# EAGLE design lipo charger (EAGLE 5.11)
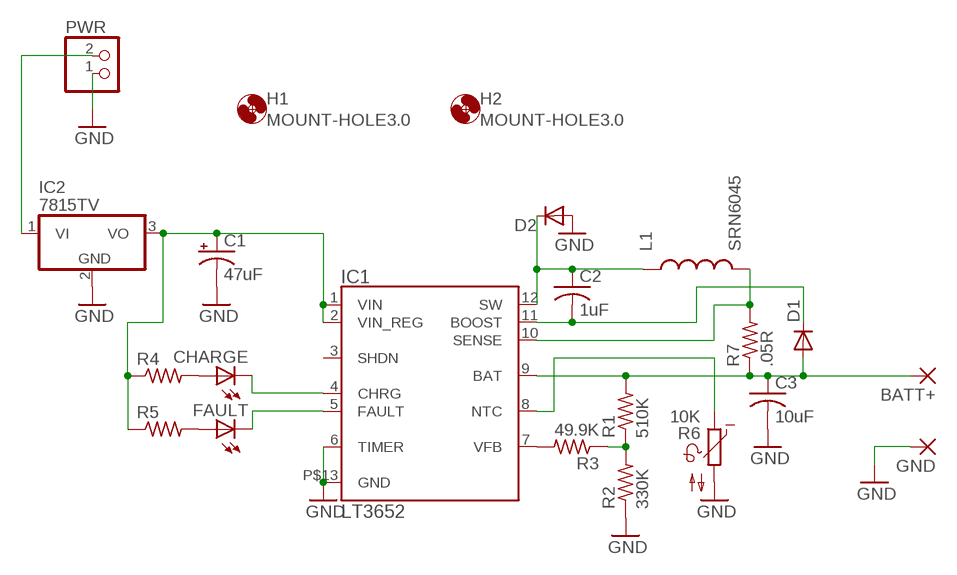
[diagram p0: schematic, sheet 1]

## Parts
BATT+  WIREPAD3,81/1,4  [3,81/1,4]
C1  47uF  CPOL-USE5-10.5  [E5-10,5]
C2  1uF  C-USC0805K  [C0805K]
C3  10uF  C-USC1206  [C1206]
CHARGE  LEDCHIPLED_0805  [CHIPLED_0805]
D1  DIODESOT23  [SOT23-3]
D2  DIODESMB  [SMB-DIODE]
FAULT  LEDCHIPLED_0805  [CHIPLED_0805]
GND  WIREPAD3,81/1,4  [3,81/1,4]
H1  MOUNT-HOLE3.0  [3,0]
H2  MOUNT-HOLE3.0  [3,0]
IC1  LT3652  [12-MSOP]
IC2  7815TV  [TO220V]
L1  SRN6045  [SRN6045]
PWR  JST_2PIN-THM  [JST-PH-2-THM]
R1  510K  R-US_R0805  [R0805]
R2  330K  R-US_R0805  [R0805]
R3  49.9K  R-US_R0805  [R0805]
R4  R-US_R0805  [R0805]
R5  R-US_R0805  [R0805]
R6  10K  NTC640  [P640]
R7  .05R  R-US_R0805  [R0805]

## Nets
GND: C1.- C3.2 D2.A GND.1(P) IC1.6(TIMER) IC1.P$13(GND) IC2.2(GND) PWR.1 R2.1 R6.2
N$1: IC1.7(VFB) R3.2
N$2: R1.1 R2.2 R3.1
N$3: BATT+.1(P) C3.1 D1.1(A) IC1.9(BAT) R1.2 R7.1
N$5: CHARGE.A R4.2
N$6: FAULT.A R5.2
N$7: CHARGE.C IC1.4(CHRG)
N$8: FAULT.C IC1.5(FAULT)
N$9: C1.+ IC1.1(VIN) IC1.2(VIN_REG) IC2.3(VO) R4.1 R5.1
N$10: IC1.8(NTC) R6.1
N$11: IC1.10(SENSE) L1.2 R7.2
N$12: C2.2 D1.3(C) IC1.11(BOOST)
N$13: C2.1 D2.C IC1.12(SW) L1.1
N$14: IC2.1(VI) PWR.2
Unconnected: IC1.3(SHDN)

## Library data of the parts
BATT+ GND = wirepad:WIREPAD: Wire PAD connect wire on PCB
C1 = adafruit:CPOL-US: POLARIZED CAPACITOR, American symbol
C2 C3 = adafruit:C-US: CAPACITOR, American symbol
CHARGE FAULT = adafruit:LED: LED OSRAM: - CHIPLED LG R971, LG N971, LY N971, LG Q971, LY Q971, LO R971, LY R971 LH N974, LH R974 LS Q976, LO Q976, LY Q976 LO Q996 - Hyper CHIPLED LW Q18S LB Q993, LB Q99A, LB R99A - SideLED LS A670, LO A670, LY A670, LG A670, LP A670 LB A673, LV A673, LT A673, LW A673 LH A674 LY A675 LS A676, LA A676, LO A676, LY A676, LW A676 LS A679, LY A679, LG A679 - Hyper Micro SIDELED® LS Y876, LA Y876, LO Y876, LY Y876 LT Y87S - SmartLED LW L88C, LW L88S LB L89C, LB L89S, LG L890 LS L89K, LO L89K, LY L89K LS L896, LA L896, LO L896, LY L896 - TOPLED LS T670, LO T670, LY T670, LG T670, LP T670 LSG T670, LSP T670, LSY T670, LOP T670, LYG T670 LG T671, LOG T671, LSG T671 LB T673, LV T673, LT T673, LW T673 LH T674 LS T676, LA T676, LO T676, LY T676, LB T676, LH T676, LSB T676, LW T676 LB T67C, LV T67C, LT T67C, LS T67K, LO T67K, LY T67K, LW E67C LS E67B, LA E67B, LO E67B, LY E67B, LB E67C, LV E67C, LT E67C LW T67C LS T679, LY T679, LG T679 LS T770, LO T770, LY T770, LG T770, LP T770 LB T773, LV T773, LT T773, LW T773 LH T774 LS E675, LA E675, LY E675, LS T675 LS T776, LA T776, LO T776, LY T776, LB T776 LHGB T686 LT T68C, LB T68C - Hyper Mini TOPLED® LB M676 - Mini TOPLED Santana® LG M470 LS M47K, LO M47K, LY M47K Source: http://www.osram.convergy.de/
D1 D2 = SparkFun:DIODE: Diode These are standard reverse protection diodes and small signal diodes. SMA package can handle up to about 1A. SOD-323 can handle about 200mA. What the SOD-323 package when ordering, there are some mfgs out there that are 5-pin packages.
H1 H2 = holes:MOUNT-HOLE: MOUNTING HOLE with drill center marker
IC1 = linear-technology:LT3652: LT3652 Power Tracking 2A Battery Charger Source: LT3652 Datasheet <http://cds.linear.com/docs/Datasheet/3652fc.pdf>
IC2 = linear:78*: Positive VOLTAGE REGULATOR Source: http://cache.national.com/ds/LM/LM78L05.pdf http://www.fairchildsemi.com/ds/LM/LM7805.pdf
L1 = bourns-inductor:SRN6045: SRN6045 SRN6045 Series - Semi-shielded Power Inductors Source: SRN6045 Series Datasheet <http://www.bourns.com/data/global/pdfs/SRN6045.pdf>
PWR = adafruit:JST_2PIN: JST 2-Pin Connectors of various flavors SMT-RA (S2B-PH-SM4) 4UConnector #17311 SMT (B2B-PH-SM4) THM-RA (S2B-PH) THM (B2B-PH)
R1-R5 R7 = adafruit:R-US_: RESISTOR, American symbol
R6 = ptc-ntc:NTC640: PHILIPS NTC; OC_FARNELL: unknown; OC_NEWARK: unknown

## Board
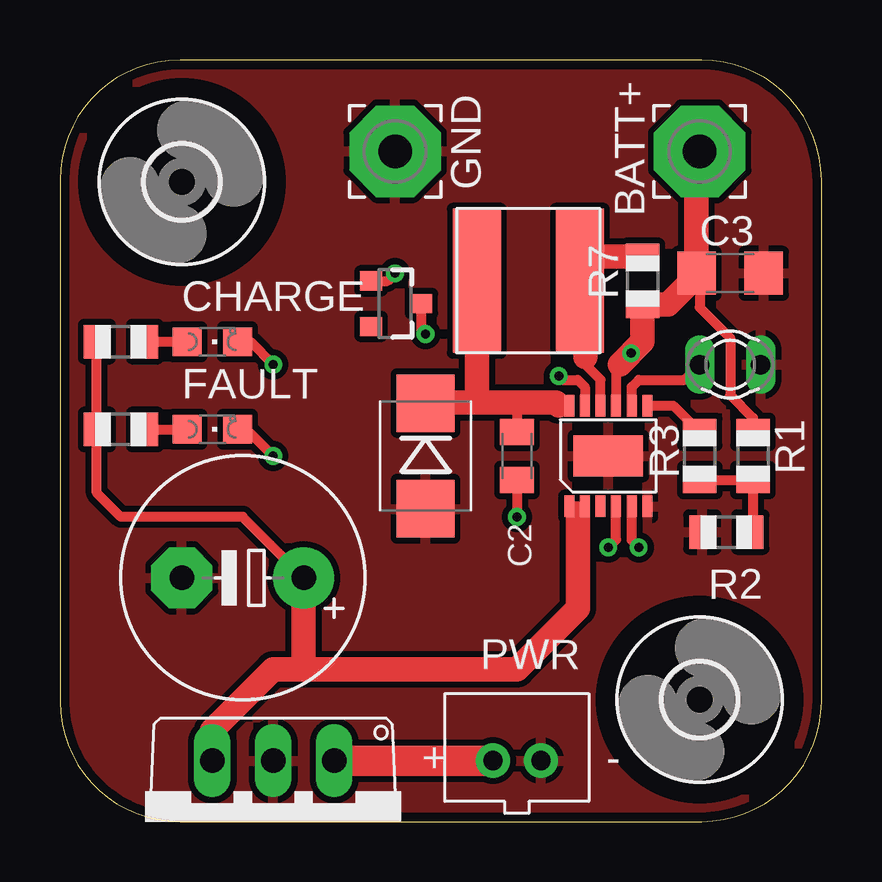
[diagram p1: board, top side]
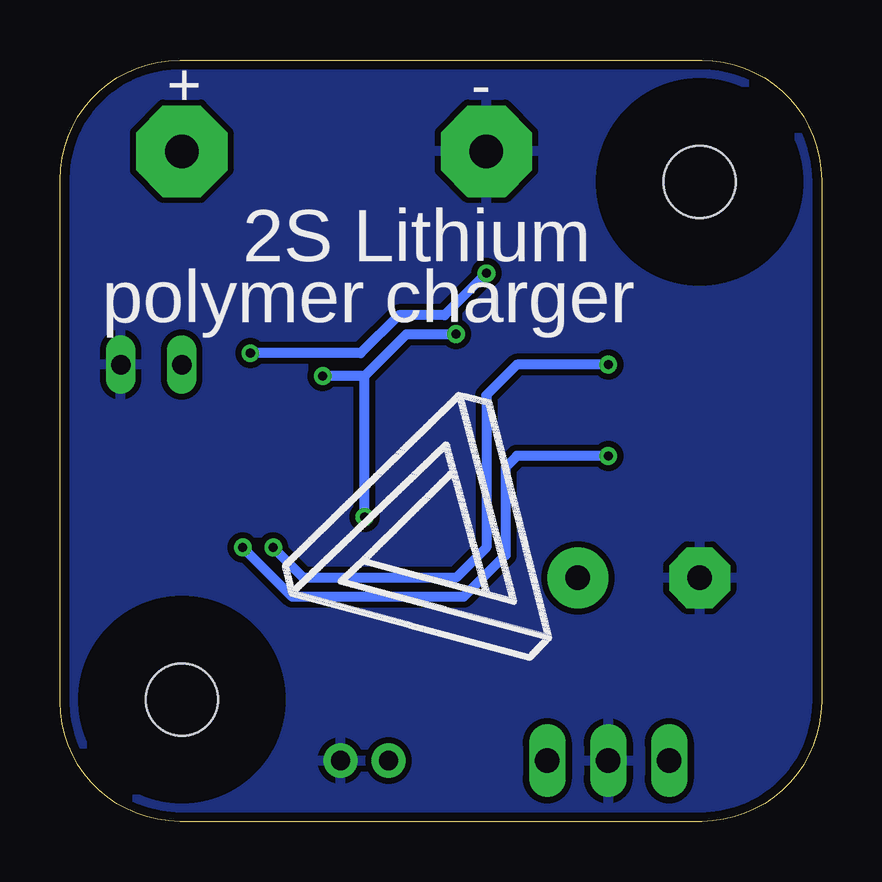
[diagram p2: board, bottom side, seen from below]

Size 31.75 x 31.75 mm. Coordinates in mm from the lower left corner, seen from the top.
Outline: 5,31.75 arc90 0,26.75 0,5 arc90 5,0 26.75,0 arc90 31.75,5 31.75,26.75 arc90 26.75,31.75 5,31.75
Copper layers (1*16): Top 0.0356mm / dielectric 1.5011mm / Bottom 0.0356mm
Design rules "LaenPCBOrder *": minimum track width 6mil, minimum drill 13mil, track to track 6mil, track to pad 6mil, pad to pad 6mil, via to via 6mil, smd to smd 6mil, copper to edge 15mil, drill to drill 6mil, minimum pad ring 7mil, minimum via ring 7mil, stop-mask expansion 4mil, vias tented up to drill 17mil, thermal gap 10mil

### Footprints (pad centres in the part's own frame; a part is rotated, then mirrored left to right if it is on the bottom)
3,81/1,4 = drill 1.397 pad 3.81 octagon: 1 0,0
E5-10,5 = drill 1.016 pad 2.54 round: + -2.54,0 | drill 1.016 pad 2.54 octagon: - 2.54,0
C0805K = smd 1.1 x 1.4: 1 -1,0; 2 1,0
C1206 = smd 1.6 x 1.8: 1 -1.4,0; 2 1.4,0
CHIPLED_0805 = smd 1.2 x 1.2: A 0,-1.05; C 0,1.05
SOT23-3 = smd 0.8 x 0.9: 1 -0.95,-1; 2 0.95,-1; 3 0,1.1
SMB-DIODE = smd 2.4 x 2.4: A 2.2,0; C -2.2,0
3,0 = hole 3: 0,0
12-MSOP = smd 0.42 x 0.9: 1 -1.625,-2.1; 2 -0.975,-2.1; 3 -0.325,-2.1; 4 0.325,-2.1; 5 0.975,-2.1; 6 1.625,-2.1; 7 1.625,2.1; 8 0.975,2.1; 9 0.325,2.1; 10 -0.325,2.1; 11 -0.975,2.1; 12 -1.625,2.1 | smd 2.9 x 1.7: P$13 0,0
TO220V = drill 1.016 long: 1 -2.54,-2.54; 2 0,-2.54; 3 2.54,-2.54
SRN6045 = smd 2 x 6: 1 -2.15,0; 2 2.15,0
JST-PH-2-THM = drill 0.8 pad 1.422 round: 1 1,0; 2 -1,0
R0805 = smd 1.1 x 1.4: 1 -1,0; 2 1,0
P640 = drill 0.813 long: 1 -1.27,0; 2 1.27,0

### Placement (x,y rotation side)
BATT+  26.67,27.94 0 top
C1  7.62,10.16 180 top
C2  19.05,15.24 270 top
C3  27.94,22.86 0 top
CHARGE  6.35,20 270 top
D1  13.97,21.59 270 top
D2  15.24,15.24 270 top
FAULT  6.35,16.35 270 top
GND  13.97,27.94 0 top
H1  5.08,26.67 0 top
H2  26.67,5.08 0 top
IC1  22.86,15.24 0 top
IC2  8.89,0 180 top
L1  19.53,22.54 0 top
PWR  19.05,2.54 0 top
R1  28.89,15.24 90 top
R2  27.78,12.07 0 top
R3  26.67,15.24 90 top
R4  2.54,20 0 top
R5  2.54,16.35 0 top
R6  27.94,19.05 0 top
R7  24.29,22.54 90 top

### Tracks (layer width: path | path; a pad name or v marks a point on that pad's centre or on a via)
GND
  pour Top (isolate 0.254): 0,0 31.75,0 31.75,31.75 0,31.75
  pour Bottom (isolate 0.254): 31.75,0 31.75,31.75 0,31.75 0,0
N$1
  Top 0.406: IC1.7 25.57,17.34 R3.2
N$2
  Top 0.406: R3.1 R1.1 28.89,12.18 R2.2
N$3  (via drill 0.38)
  Top 0.406: IC1.9 23.18,18.9 23.34,19.05 | D1.1 13.65,22.54 v13.97,22.86 | 24.29,20 | v23.81,19.53 24.29,20 | R1.2 28.89,16.83 27.94,17.78 27.94,20.16 26.67,21.43 26.67,22.73 C3.1
  Top 1.016: 23.34,19.05 24.29,20 R7.1 | R7.1 | R7.1 25.35,21.54 26.54,22.73 C3.1 26.54,27.81 BATT+.1
  Bottom 0.406: v13.97,22.86 15.72,21.11 17.62,21.11 19.21,19.53 v23.81,19.53
N$5
  Top 0.406: R4.2 CHARGE.A
N$6
  Top 0.406: R5.2 FAULT.A
N$7  (via drill 0.38)
  Top 0.406: IC1.4 23.18,11.76 v22.86,11.43 | CHARGE.C 7.94,20 v8.89,19.05
  Bottom 0.406: v22.86,11.43 21.59,10.16 15.24,10.16 13.97,11.43 13.97,17.78 12.7,19.05 v8.89,19.05
N$8  (via drill 0.38)
  Top 0.406: IC1.5 23.84,11.72 v24.13,11.43 | FAULT.C 7.78,16.35 v8.89,15.24
  Bottom 0.406: v24.13,11.43 22.07,9.37 14.92,9.37 13.18,11.11 13.18,14.76 12.7,15.24 v8.89,15.24
N$9
  Top 0.406: 21.59,13.14 IC1.1 | 21.59,13.14 IC1.2 | 21.59,12.7 21.59,13.14 | R4.1 R5.1 1.54,13.7 2.54,12.7 7.62,12.7 C1.+
  Top 1.016: IC2.3 6.35,3.81 8.89,6.35 10.16,6.35 | 10.16,6.35 19.05,6.35 21.59,8.89 21.59,12.7 | 10.16,6.35 C1.+
N$10
  Top 0.406: IC1.8 23.84,18.12 24.13,18.41 26.04,18.41 R6.1
N$11
  Top 0.406: IC1.10 22.54,18.42 21.91,19.05 21.91,19.37 | 21.91,21.66 L1.2
  Top 1.016: R7.2 21.95,23.54 21.59,23.18 21.75,22.61 L1.2 | 21.91,19.37 21.91,21.66
N$12  (via drill 0.38)
  Top 0.406: IC1.11 21.89,18.12 21.59,18.41 20.95,18.41 v20.8,18.57 | C2.2 v19.05,12.7 | D1.3 15.07,20.49 v15.24,20.32
  Bottom 0.406: v15.24,20.32 17.3,20.32 19.05,18.57 | v19.05,12.7 19.05,18.57 | 19.05,18.57 v20.8,18.57
N$13
  Top 0.406: 19.88,17.34 20.8,17.34 IC1.12 | 19.05,17.46 C2.1
  Top 1.016: 20.8,17.34 20.67,17.46 19.05,17.46 17.46,17.46 | 17.46,17.46 15.26,17.46 D2.C | L1.1 17.38,17.55 17.46,17.46
N$14
  Top 1.27: IC2.1 PWR.2

### Text on the board
bPlace: - | + | 2S Lithium | polymer charger